# EAGLE design pic18spx (EAGLE 5.10)
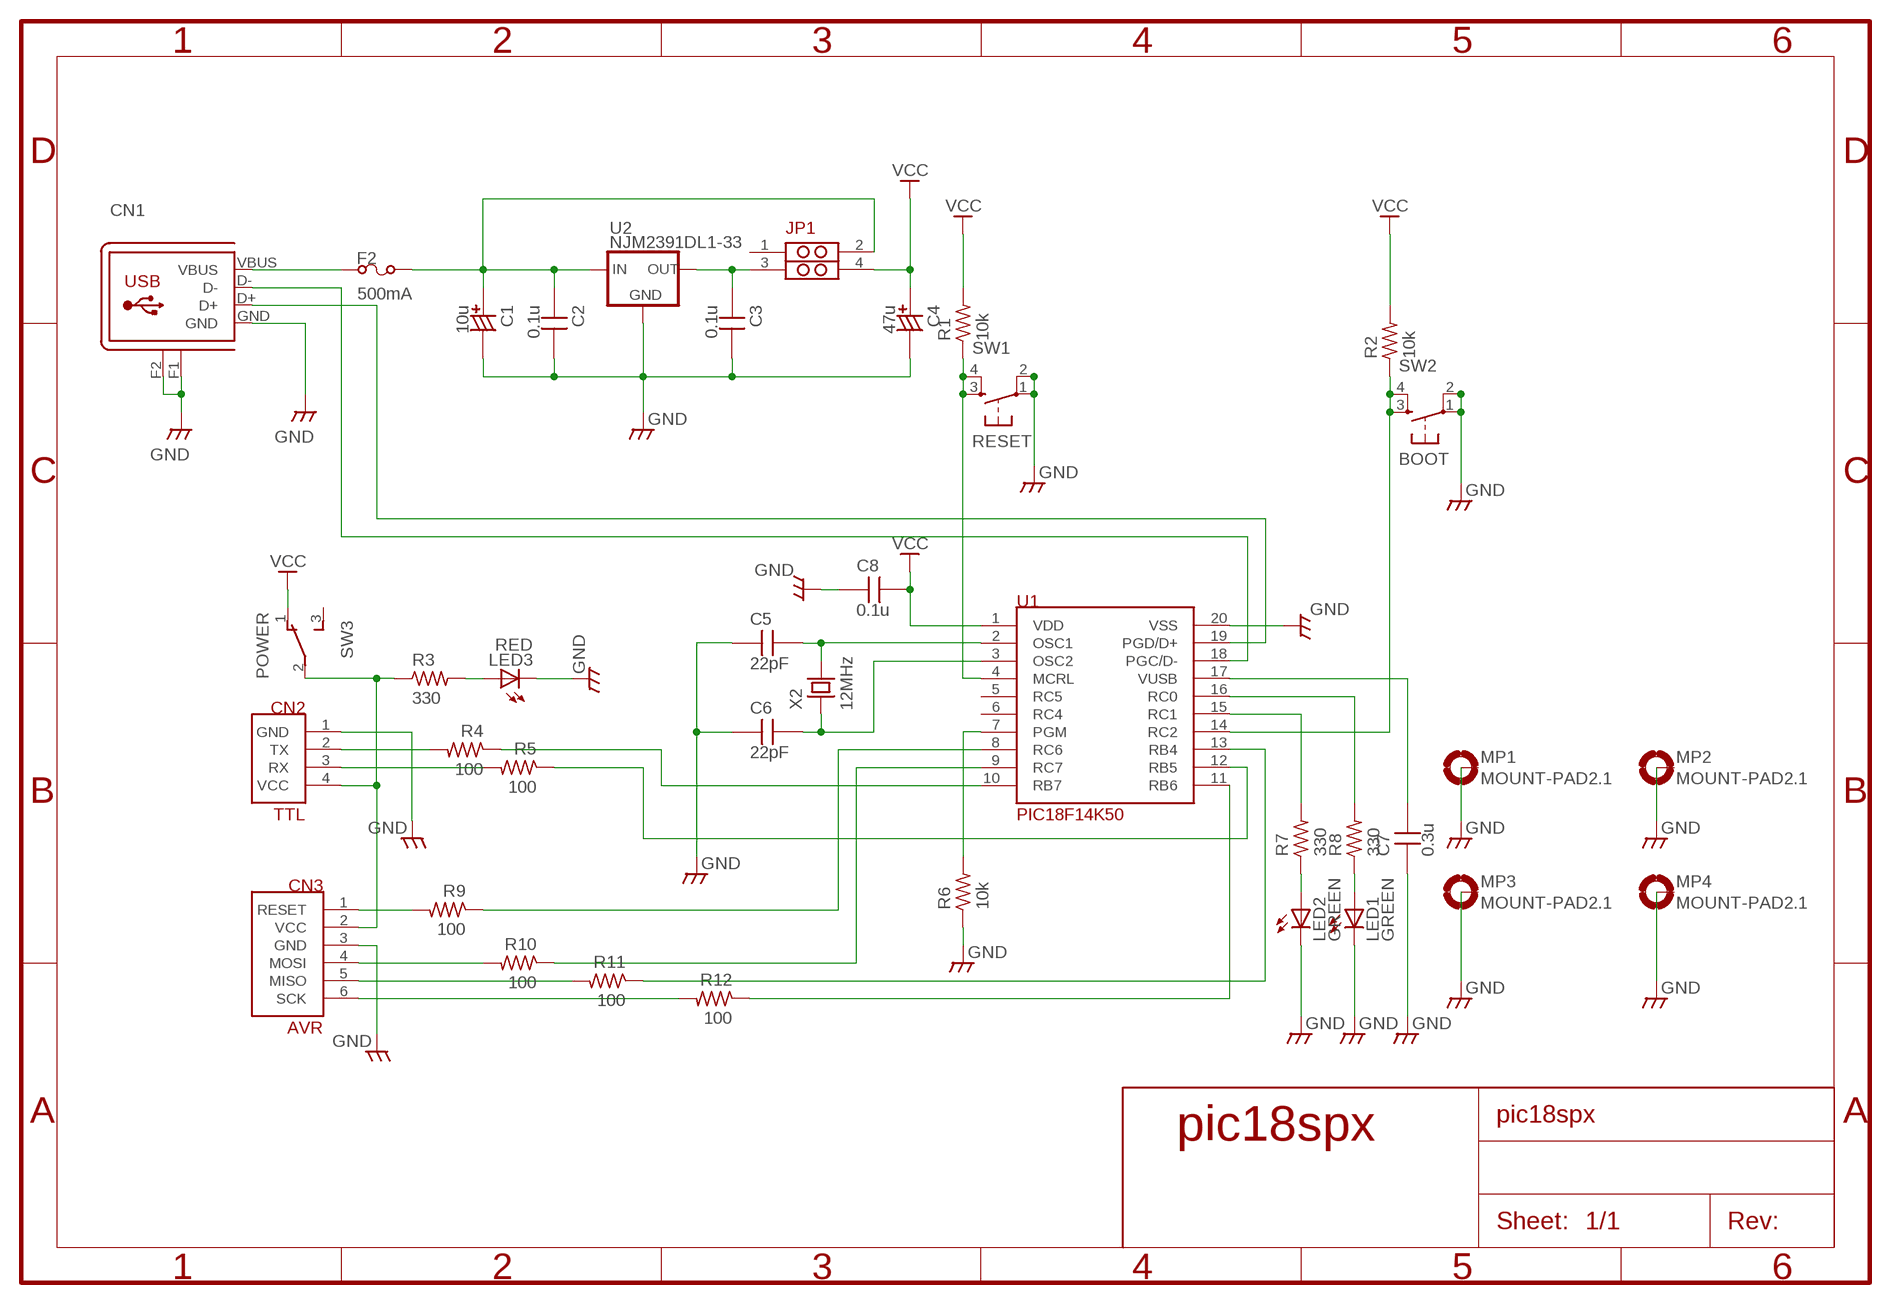
[diagram p0: schematic, sheet 1]

## Parts
C1  10u  CCAP6.5  [CCAP_6.5]
C2  0.1u  CAPSM1608  [C1608]
C3  0.1u  CAPSM1608  [C1608]
C4  47u  CCAP6.5  [CCAP_6.5]
C5  22pF  CAPDIP_1  [CAP_DIP_1]
C6  22pF  CAPDIP_1  [CAP_DIP_1]
C7  0.3u  CAPDIP_1  [CAP_DIP_1]
C8  0.1u  CAPDIP_2  [CAP_DIP_2]
CN1  USB-B-H  [USB-B-H]
CN2  TTL  TTL_4P  [CON_HRS_DIP_4]
CN3  AVR  HIDASPX_CON_6P  [CON_HRS_DIP_6]
F2  500mA  POLYSW-N/200  [F-N/200]
JP1  CROSS_JUMPER_PIN  [2X02]
LED1  GREEN  LED3MM  [LED3MM]
LED2  GREEN  LED3MM  [LED3MM]
LED3  RED  LED3MM  [LED3MM]
MP1  MOUNT-PAD2.1  [PAD-2.1]
MP2  MOUNT-PAD2.1  [PAD-2.1]
MP3  MOUNT-PAD2.1  [PAD-2.1]
MP4  MOUNT-PAD2.1  [PAD-2.1]
R1  10k  R0.125W_4P  [R_0.125W_4]
R2  10k  R0.125W_4P  [R_0.125W_4]
R3  330  R0.125W_4P  [R_0.125W_4]
R4  100  R0.125W_4P  [R_0.125W_4]
R5  100  R0.125W_4P  [R_0.125W_4]
R6  10k  R0.125W_4P  [R_0.125W_4]
R7  330  R0.125W_4P  [R_0.125W_4]
R8  330  R0.125W_4P  [R_0.125W_4]
R9  100  R0.125W_4P  [R_0.125W_4]
R10  100  R0.125W_4P  [R_0.125W_4]
R11  100  R0.125W_4P  [R_0.125W_4]
R12  100  R0.125W_4P  [R_0.125W_4]
SW1  RESET  TACT-SW  [B3F-10X]
SW2  BOOT  TACT-SW  [B3F-10X]
SW3  POWER  SLIDESW-3  [DS-3]
U1  PIC18F14K50  [DIL20]
U2  NJM2391DL1-33  [TO252]
X2  12MHz  XTAL'49U/LM'  [HC49U-LM]

## Nets
GND: C1.- C2.2 C3.2 C4.- C5.1 C6.1 C7.1 C8.1 CN1.F1(S2) CN1.F2(S1) CN1.GND CN2.1(GND) CN3.3(GND) LED1.K(C) LED2.K(C) LED3.K(C) MP1.B2,1(MOUNT) MP2.B2,1(MOUNT) MP3.B2,1(MOUNT) MP4.B2,1(MOUNT) R6.1 SW1.1(P) SW1.2(P1) SW2.1(P) SW2.2(P1) U1.20(VSS) U2.3(GND)
N$1: R1.1 SW1.3(S) SW1.4(S1) U1.4(MCRL)
N$2: CN1.VBUS F2.2
N$3: C1.+ C2.1 F2.1 JP1.2 U2.1(IN)
N$4: R2.1 SW2.3(S) SW2.4(S1) U1.14(RC2)
N$5: CN3.1(RESET) R9.2
N$6: C6.2 U1.3(OSC2) X2.1
N$7: R8.2 U1.16(RC0)
N$8: LED2.A R7.1
N$9: R7.2 U1.15(RC1)
N$10: C5.2 U1.2(OSC1) X2.2
N$11: C7.2 U1.17(VUSB)
N$12: R9.1 U1.8(RC6)
N$13: R6.2 U1.7(PGM)
N$14: CN1.D+ U1.19(PGD/D+)
N$15: CN1.D- U1.18(PGC/D-)
N$16: CN3.4(MOSI) R10.2
N$17: CN3.5(MISO) R11.2
N$18: R10.1 U1.9(RC7)
N$19: CN3.6(SCK) R12.2
N$20: LED1.A R8.1
N$21: R11.1 U1.13(RB4)
N$22: R12.1 U1.11(RB6)
N$23: CN2.2(TX) R4.2
N$24: CN2.3(RX) R5.2
N$25: R4.1 U1.10(RB7)
N$26: R5.1 U1.12(RB5)
N$27: LED3.A R3.2
N$29: C3.1 JP1.3 U2.2(OUT)
N$32: CN2.4(VCC) CN3.2(VCC) R3.1 SW3.2(P)
VCC: C4.+ C8.2 JP1.4 R1.2 R2.2 SW3.1(O) U1.1(VDD)
Unconnected: JP1.1 SW3.3(S) U1.5(RC5) U1.6(RC4)

## Notes on the sheet
- pic18spx

## Library data of the parts
C1 C4 = MyLib:CCAP: Polar capacitor
C2 C3 C5-C8 = MyLib:CAP: Non polar capacitor
CN1 = con-usb2:USB: OMRON - USB Connectors
CN2 = bant:TTL_4P
CN3 = bant:HIDASPX_CON_6P
F2 = MyLib:POLYSW
JP1 = bant:CROSS_JUMPER_PIN
LED1-LED3 = led:LED: LED OSRAM: - CHIPLED LG R971, LG N971, LY N971, LG Q971, LY Q971, LO R971, LY R971 LH N974, LH R974 LS Q976, LO Q976, LY Q976 LO Q996 - Hyper CHIPLED LW Q18S LB Q993, LB Q99A, LB R99A - SideLED LS A670, LO A670, LY A670, LG A670, LP A670 LB A673, LV A673, LT A673, LW A673 LH A674 LY A675 LS A676, LA A676, LO A676, LY A676, LW A676 LS A679, LY A679, LG A679 - Hyper Micro SIDELEDR LS Y876, LA Y876, LO Y876, LY Y876 LT Y87S - SmartLED LW L88C, LW L88S LB L89C, LB L89S, LG L890 LS L89K, LO L89K, LY L89K LS L896, LA L896, LO L896, LY L896 - TOPLED LS T670, LO T670, LY T670, LG T670, LP T670 LSG T670, LSP T670, LSY T670, LOP T670, LYG T670 LG T671, LOG T671, LSG T671 LB T673, LV T673, LT T673, LW T673 LH T674 LS T676, LA T676, LO T676, LY T676, LB T676, LH T676, LSB T676, LW T676 LB T67C, LV T67C, LT T67C, LS T67K, LO T67K, LY T67K, LW E67C LS E67B, LA E67B, LO E67B, LY E67B, LB E67C, LV E67C, LT E67C LW T67C LS T679, LY T679, LG T679 LS T770, LO T770, LY T770, LG T770, LP T770 LB T773, LV T773, LT T773, LW T773 LH T774 LS E675, LA E675, LY E675, LS T675 LS T776, LA T776, LO T776, LY T776, LB T776 LHGB T686 LT T68C, LB T68C - Hyper Mini TOPLEDR LB M676 - Mini TOPLED SantanaR LG M470 LS M47K, LO M47K, LY M47K Source: http://www.osram.convergy.de LUXEON: - LUMILEDR LXK2-PW12-R00, LXK2-PW12-S00, LXK2-PW14-U00, LXK2-PW14-V00 LXK2-PM12-R00, LXK2-PM12-S00, LXK2-PM14-U00 LXK2-PE12-Q00, LXK2-PE12-R00, LXK2-PE12-S00, LXK2-PE14-T00, LXK2-PE14-U00 LXK2-PB12-K00, LXK2-PB12-L00, LXK2-PB12-M00, LXK2-PB14-N00, LXK2-PB14-P00, LXK2-PB14-Q00 LXK2-PR12-L00, LXK2-PR12-M00, LXK2-PR14-Q00, LXK2-PR14-R00 LXK2-PD12-Q00, LXK2-PD12-R00, LXK2-PD12-S00 LXK2-PH12-R00, LXK2-PH12-S00 LXK2-PL12-P00, LXK2-PL12-Q00, LXK2-PL12-R00 Source: www.luxeon.com KINGBRIGHT: KA-3528ASYC Source: www.kingbright.com
MP1-MP4 = MyLib:MOUNT-PAD: 2.1mm Mount Pad (Connectable to GND)
R1-R12 = MyLib:R: General Resiter 1/8W 1/4W 1/2W V/H
SW1 SW2 = MyLib:TACT-SW: Tacticle Push Switch
SW3 = MyLib:SLIDESW-3: 3P Slide Switch
U1 = bant:PIC18F14K50
U2 = bant:NJM2391DL1-*
X2 = Xtal:XTAL: Crystal Oscillator HC49U/S

## Board
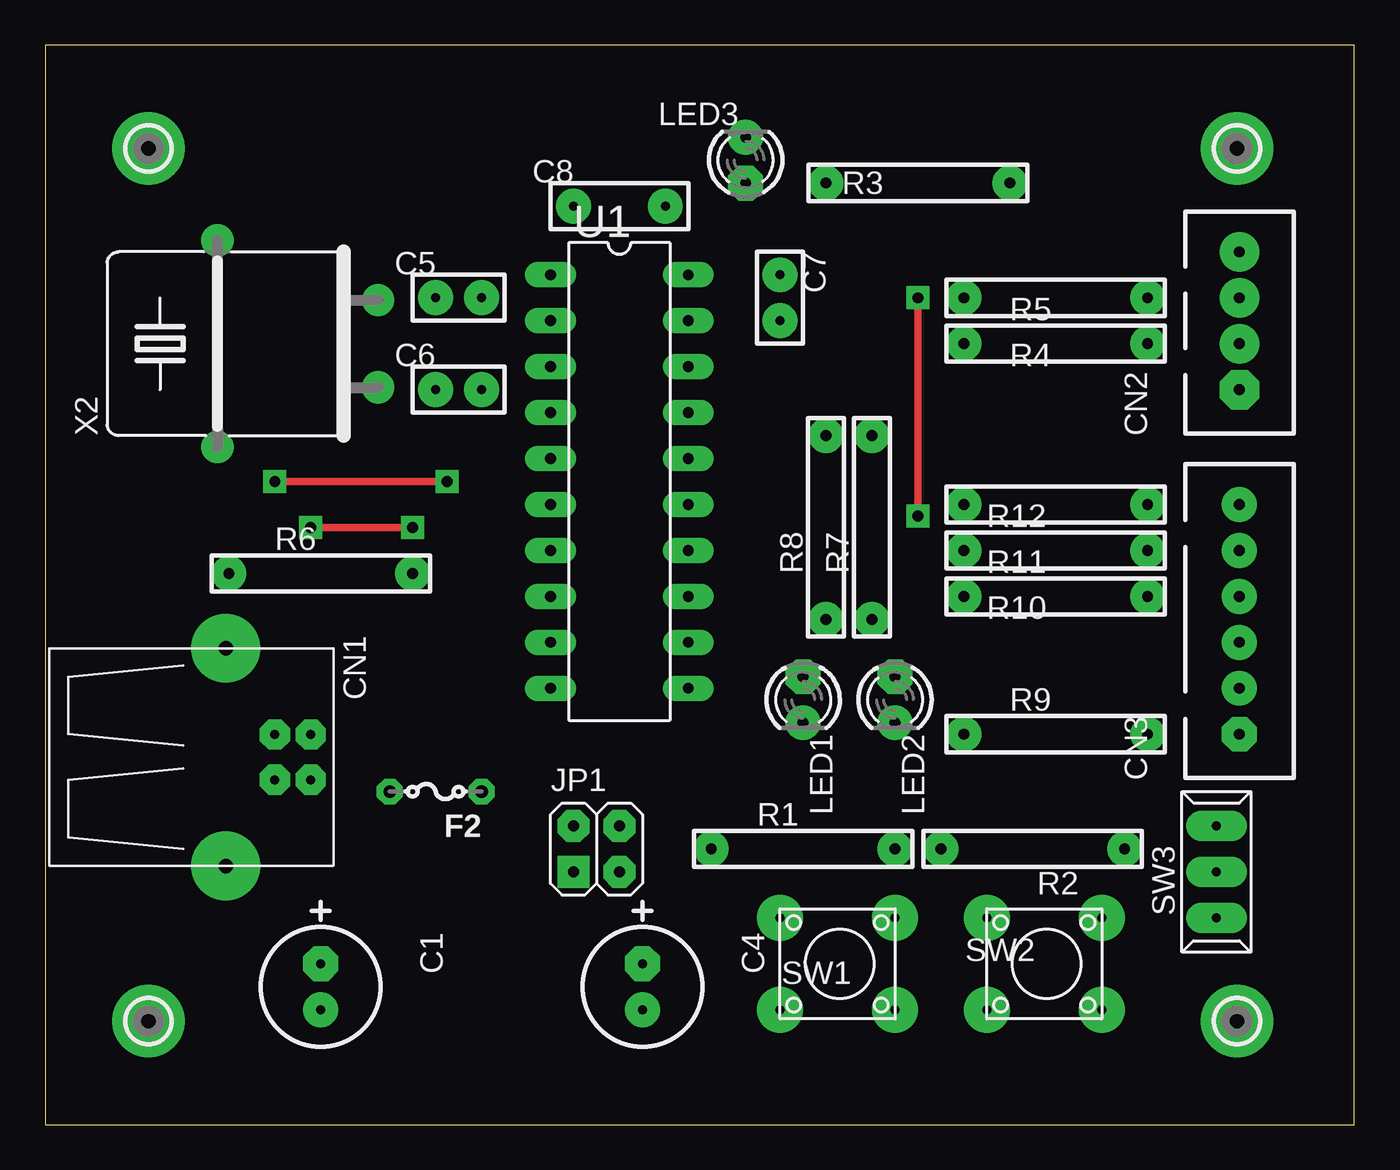
[diagram p1: board, top side]
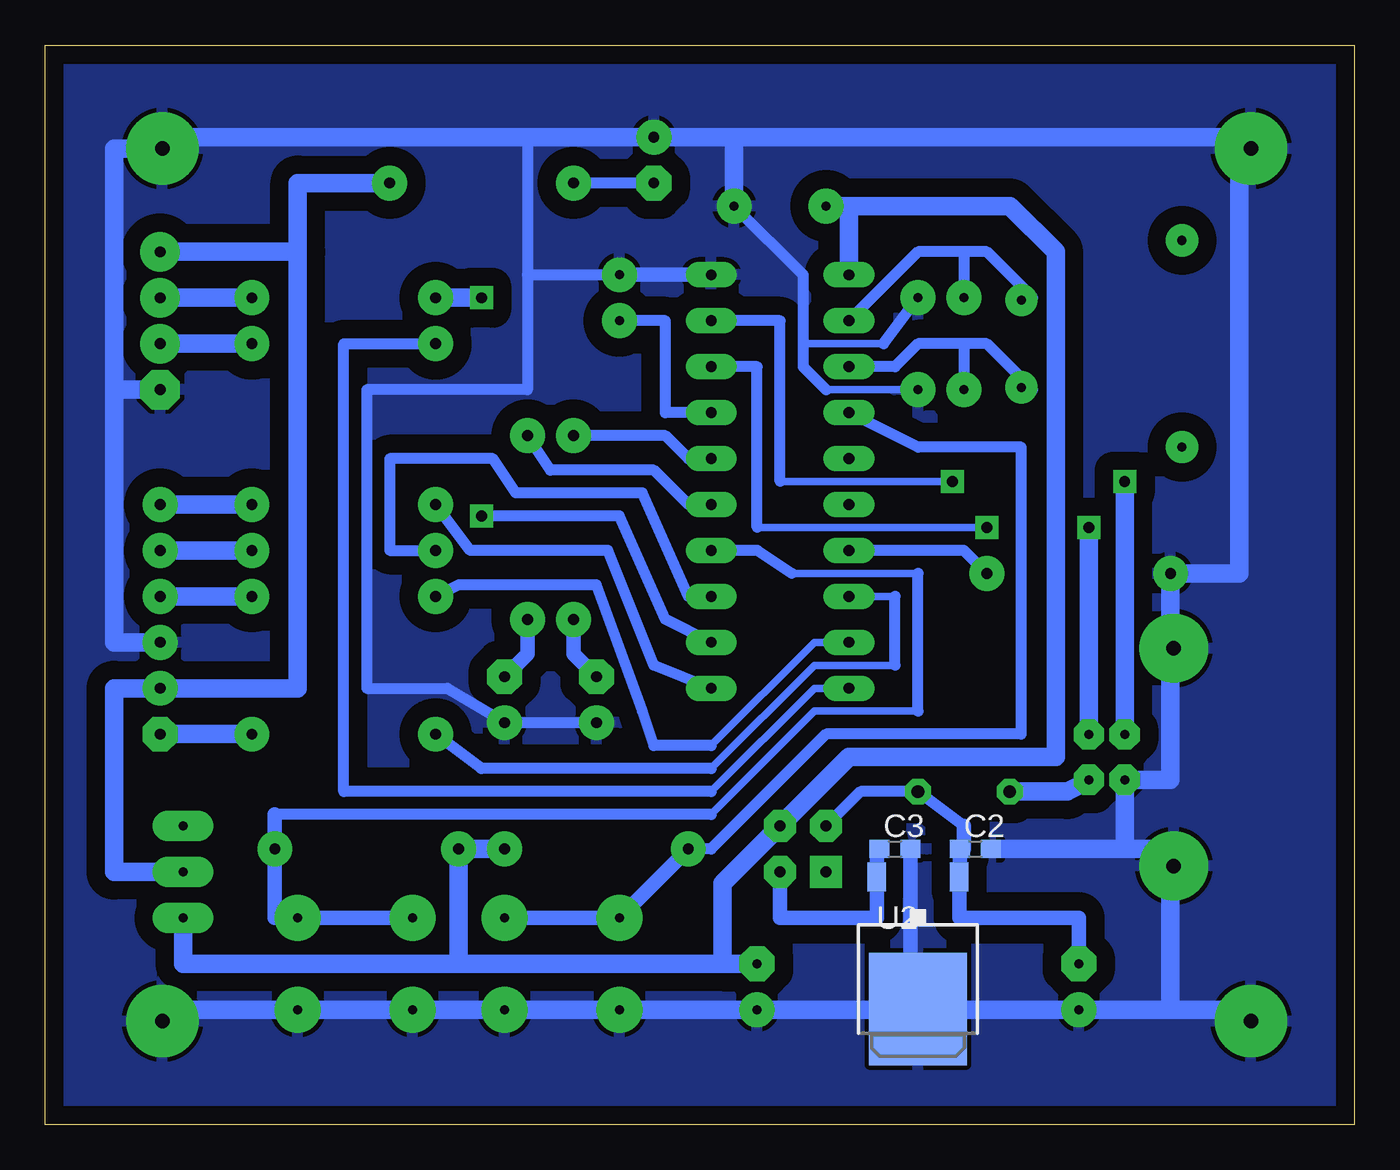
[diagram p2: board, bottom side, seen from below]

Size 72.39 x 59.69 mm. Coordinates in mm from the lower left corner, seen from the top.
Outline: 0,0 72.39,0 72.39,59.69 0,59.69 0,0
Copper layers (1*16): Top 0.035mm / dielectric 1.5mm / Bottom 0.035mm
Design rules "default": minimum track width 10mil, minimum drill 24mil, track to track 8mil, track to pad 8mil, pad to pad 8mil, via to via 8mil, smd to smd 8mil, copper to edge 40mil, drill to drill 8mil, minimum pad ring 10mil, minimum via ring 8mil, stop-mask expansion 4mil, vias tented up to drill 0mil, thermal gap 10mil

### Footprints (pad centres in the part's own frame; a part is rotated, then mirrored left to right if it is on the bottom)
CCAP_6.5 = drill 0.5 pad 1.93 octagon: + -1.27,0 | drill 0.5 pad 1.93 round: - 1.27,0
C1608 = smd 1.1 x 1: 1 -0.85,0; 2 0.85,0
CAP_DIP_1 = drill 0.5 pad 1.93 round: 1 -1.27,0; 2 1.27,0
CAP_DIP_2 = drill 0.5 pad 1.93 round: 1 -2.54,0; 2 2.54,0
USB-B-H = drill 0.5 pad 1.676 octagon: D+ 0,1.25; D- 1.981,1.25; GND 0,-1.25; VBUS 1.981,-1.25 | drill 0.8 pad 3.81 round: F1 -2.718,6.02; F2 -2.718,-6.02
CON_HRS_DIP_4 = drill 0.6 pad 2.184 octagon: 1 -3.81,0 | drill 0.6 pad 2.184 round: 2 -1.27,0; 3 1.27,0; 4 3.81,0
CON_HRS_DIP_6 = drill 0.6 pad 1.93 octagon: 1 -6.35,0 | drill 0.6 pad 1.93 round: 2 -3.81,0; 3 -1.27,0; 4 1.27,0; 5 3.81,0; 6 6.35,0
F-N/200 = drill 0.7 pad 1.422 octagon: 1 -2.54,0; 2 2.54,0
2X02 = drill 0.6 pad 1.778 square: 1 -1.27,-1.27 | drill 0.6 pad 1.778 octagon: 2 -1.27,1.27; 3 1.27,-1.27; 4 1.27,1.27
LED3MM = drill 0.6 pad 1.93 octagon: A -1.27,0 | drill 0.6 pad 1.93 round: K 1.27,0
PAD-2.1 = drill 0.8 pad 4 round: B2,1 0,0
R_0.125W_4 = drill 0.6 pad 1.93 round: 1 -5.08,0; 2 5.08,0
B3F-10X = drill 0.5 pad 2.54 round: 1 -1.27,2.54; 2 5.08,2.54; 3 -1.27,-2.54; 4 5.08,-2.54
DS-3 = drill 0.5 pad 1.676 long: 1 0,-2.54; 2 0,0; 3 0,2.54
DIL20 = drill 0.6 pad 1.422 long: 1 -11.43,-3.81; 2 -8.89,-3.81; 3 -6.35,-3.81; 4 -3.81,-3.81; 5 -1.27,-3.81; 6 1.27,-3.81; 7 3.81,-3.81; 8 6.35,-3.81; 9 8.89,-3.81; 10 11.43,-3.81; 11 11.43,3.81; 12 8.89,3.81; 13 6.35,3.81; 14 3.81,3.81; 15 1.27,3.81; 16 -1.27,3.81; 17 -3.81,3.81; 18 -6.35,3.81; 19 -8.89,3.81; 20 -11.43,3.81
TO252 = smd 1 x 1.6: 1 -2.28,-4.8; 2 2.28,-4.8 | smd 5.4 x 6.2: 3 0,2.5
HC49U-LM = drill 0.5 pad 1.778 round: 1 -2.413,-5.08; 2 2.413,-5.08; M -5.715,3.81; M1 5.715,3.81

### Placement (x,y rotation side)
C1  15.24,7.62 270 top
C2  20.95,15.24 0 bottom
C3  25.4,15.24 0 bottom
C4  33.02,7.62 270 top
C5  22.86,45.72 180 top
C6  22.86,40.64 180 top
C7  40.64,45.72 270 top
C8  31.75,50.8 180 top
CN1  12.7,20.32 0 top
CN2  66.04,44.45 90 top
CN3  66.04,27.94 90 top
F2  21.59,18.41 180 top
JP1  30.48,15.24 0 top
LED1  41.91,23.5 270 top
LED2  46.99,23.5 270 top
LED3  38.73,53.34 90 top
MP1  65.91,53.98 0 top
MP2  5.71,53.98 180 top
MP3  65.91,5.71 0 top
MP4  5.71,5.71 0 top
R1  41.91,15.24 0 top
R2  54.61,15.24 180 top
R3  48.26,52.07 180 top
R4  55.88,43.18 0 top
R5  55.88,45.72 0 top
R6  15.24,30.48 0 top
R7  45.72,33.02 90 top
R8  43.18,33.02 90 top
R9  55.88,21.59 0 top
R10  55.88,29.21 0 top
R11  55.88,31.75 0 top
R12  55.88,34.29 0 top
SW1  45.72,8.89 180 top
SW2  57.15,8.89 180 top
SW3  64.77,13.97 0 top
U1  31.75,35.56 270 top
U2  24.13,8.89 180 bottom
X2  13.34,43.18 90 top

### Tracks (layer width: path | path; a pad name or v marks a point on that pad's centre or on a via)
GND
  Bottom 0.254: MP1.B2,1 66.04,53.98 | C3.2 24.13,15.24 | CN1.F1 10.16,26.67 | 12.7,19.05 CN1.GND | 24.13,6.35 U2.3 | 38.1,54.61 LED3.K
  Bottom 0.406: 29.21,40.64 C6.1 | 30.48,43.18 26.04,43.18 | U2.3 24.55,6.39
  Bottom 0.61: 29.21,40.64 30.48,41.91 30.48,43.18 30.48,46.99 C8.1 | 26.04,43.18 C5.1 | LED1.K LED2.K 50.16,24.13 54.61,24.13 54.61,40.64 45.72,40.64 45.72,46.99 | 45.72,46.99 C7.1 | 45.72,54.61 45.72,46.99 | 64.77,54.61 MP1.B2,1 | 10.16,15.24 CN1.F2 10.16,13.97 | MP4.B2,1 6.35,6.35 | 6.35,53.34 MP2.B2,1 | 10.16,25.4 CN1.F1
  Bottom 0.813: C7.1 U1.20 | 24.55,6.39 C3.2
  Bottom 1.016: CN3.3 68.58,26.67 68.58,40.64 | 68.58,40.64 CN2.1 | 64.77,54.61 45.72,54.61 LED3.K | 68.58,40.64 68.58,53.98 66.04,53.98 | MP3.B2,1 64.77,6.35 SW2.1 SW2.2 SW1.1 SW1.2 C4.- 24.13,6.35 C1.- 10.16,6.35 | 10.16,15.24 12.7,15.24 | 12.7,15.24 C2.2 | 12.7,15.24 12.7,19.05 10.16,19.05 10.16,25.4 | 6.35,6.35 10.16,6.35 | 10.16,6.35 10.16,13.97 | 10.16,26.67 R6.1 6.35,30.48 6.35,53.34 | 34.29,54.61 6.35,54.61 MP2.B2,1 | 34.29,54.61 38.1,54.61 | 34.29,54.61 C8.1
  pour Bottom (isolate 1.016): 0,59.69 0,0 72.39,0 72.39,59.69
N$1
  Bottom 0.61: U1.4 24.13,37.47 18.41,37.47 18.41,21.59 29.21,21.59 35.56,15.24 R1.1
  Bottom 0.813: R1.1 SW1.4 SW1.3
N$2
  Bottom 1.016: F2.2 15.88,18.41 14.61,19.05 CN1.VBUS
N$3
  Bottom 0.254: 21.8,13.97 21.59,13.97 U2.1
  Bottom 0.406: C2.1 21.59,15.24
  Bottom 0.61: JP1.2 27.3,18.41 F2.1 21.59,16.51
  Bottom 0.813: C1.+ 15.24,11.43 21.85,11.43 U2.1 | 21.8,13.97 C2.1 | 21.59,15.24 21.59,16.51
N$4
  Bottom 0.406: 24.13,30.48 31.11,30.48 | 24.13,22.86 29.84,22.86 35.56,17.14
  Bottom 0.61: U1.14 33.02,31.75 31.11,30.48 | 24.13,22.86 24.13,30.48 | 35.56,17.14 59.69,17.14
  Bottom 0.813: 59.69,17.14 R2.1 59.69,11.43 SW2.3 SW2.4
N$5
  Bottom 1.016: R9.2 CN3.1
N$6
  Bottom 0.254: X2.1 17.78,40.64
  Bottom 0.61: U1.3 25.4,41.91 24.13,43.18 21.59,43.18 | 21.59,43.18 20.32,43.18 17.78,40.64 | 21.59,43.18 C6.2
N$7
  Bottom 0.61: U1.16 36.83,36.83 38.1,38.1 R8.2
N$8
  Bottom 0.813: LED2.A 45.72,26.04 R7.1
N$9
  Bottom 0.61: U1.15 36.83,34.29 38.73,36.2 44.45,36.2 R7.2
N$10
  Bottom 0.254: X2.2 17.78,45.72
  Bottom 0.61: U1.2 24.13,48.26 21.59,48.26 | 21.59,48.26 20.32,48.26 17.78,45.72 | 21.59,48.26 C5.2
N$11
  Bottom 0.61: U1.17 38.1,39.37 38.1,44.45 C7.2
N$12
  Bottom 0.406: 25.4,29.21 U1.8 | 25.4,25.4 29.84,25.4 35.56,19.68
  Bottom 0.61: 25.4,25.4 25.4,29.21 | 35.56,19.68 48.26,19.68 R9.1
N$13
  Bottom 0.61: R6.2 21.59,31.75 U1.7
N$14  (via drill 0.6 pad 1.27)
  Top 0.406: v12.7,35.56 v22.23,35.56
  Bottom 0.406: v22.23,35.56 31.75,35.56
  Bottom 0.61: U1.19 31.75,44.45 31.75,35.56
  Bottom 1.016: CN1.D+ v12.7,35.56
N$15  (via drill 0.6 pad 1.27)
  Top 0.406: v14.68,33.02 v20.32,33.02
  Bottom 0.406: v20.32,33.02 33.02,33.02
  Bottom 0.61: U1.18 33.02,41.91 33.02,33.02
  Bottom 1.016: CN1.D- v14.68,33.02
N$16
  Bottom 1.016: R10.2 CN3.4
N$17
  Bottom 1.016: R11.2 CN3.5
N$18
  Bottom 0.406: U1.9 29.84,26.67 35.56,20.95
  Bottom 0.61: 35.56,20.95 38.73,20.95 39.37,22.86 41.91,29.84 49.53,29.84 R10.1
N$19
  Bottom 1.016: R12.2 CN3.6
N$20
  Bottom 0.254: LED1.A 41.91,24.13
  Bottom 0.813: LED1.A 43.18,26.04 R8.1
N$21
  Bottom 0.61: U1.13 36.83,29.21 39.37,34.92 46.35,34.92 47.62,36.83 53.34,36.83 53.34,31.75 R11.1
N$22
  Bottom 0.61: U1.11 38.73,25.4 41.27,31.75 48.9,31.75 R12.1
N$23
  Bottom 1.016: R4.2 CN2.2
N$24
  Bottom 1.016: R5.2 CN2.3
N$25
  Bottom 0.406: U1.10 29.84,24.13 35.56,18.41
  Bottom 0.61: 35.56,18.41 55.88,18.41 55.88,43.18 R4.1
N$26  (via drill 0.6 pad 1.27)
  Top 0.406: v48.26,33.66 v48.26,45.72
  Bottom 0.61: U1.12 38.1,27.94 40.64,33.66 v48.26,33.66
  Bottom 1.016: v48.26,45.72 R5.1
N$27
  Bottom 0.61: LED3.A R3.2
N$29
  Bottom 0.254: U2.2 26.67,13.97
  Bottom 0.406: 26.41,15.24 C3.1
  Bottom 0.813: JP1.3 31.75,11.43 26.41,11.43 U2.2 26.41,15.24
N$32
  Bottom 1.016: SW3.2 68.58,13.97 68.58,24.13 CN3.2 58.42,24.13 58.42,48.26 | 58.42,48.26 58.42,52.07 R3.1 | 58.42,48.26 CN2.4
VCC
  Bottom 1.016: R1.2 R2.2 49.53,8.89 | SW3.1 64.77,8.89 49.53,8.89 | 34.92,8.89 C4.+ | 34.92,8.89 49.53,8.89 | 34.92,8.89 34.92,13.34 JP1.4 27.94,20.32 16.51,20.32 16.51,48.26 19.05,50.8 27.94,50.8 | 27.94,50.8 C8.2 | 27.94,50.8 U1.1